# Altium schematic sheet power.SchDoc: Power
size A4; DrawnBy: Adrianna Ascalon
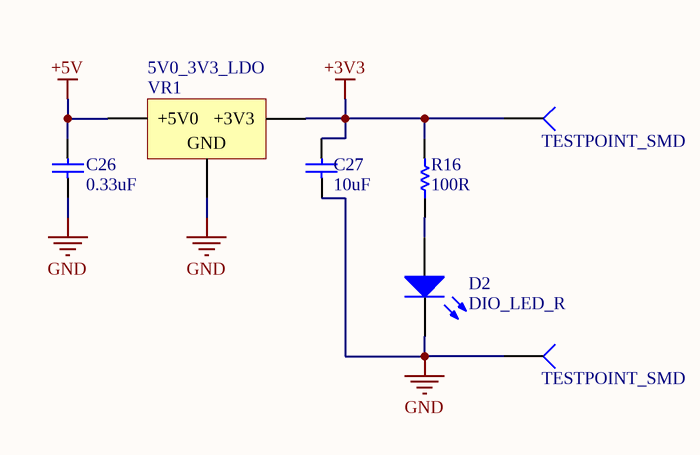
[diagram p0: power.SchDoc]

## Parts
3V3  TESTPOINT_SMD  [TESTPOINT]
C26  value 0.33uF  [CAPC0603(1608)55_N]  (hidden comment: CAP_0.33uF_16V_0603)
C27  10uF  [AVX-CAPC3528_V]
D2  DIO_LED_R  [LED_0805_LINE]
GND  TESTPOINT_SMD  [TESTPOINT]
R16  value 100R  [RESC0603(1608)_N]  (hidden comment: RES_100R_0603)
VR1  5V0_3V3_LDO  [VOLTAGE_REGULATOR]

## Nets
+3V3: 3V3.1(=value) C27.2 R16.2 VR1.2(+3V3)
+5V: C26.2 VR1.3(+5V0)
GND: C26.1 C27.1 D2.2(K) GND.1(=value) VR1.1(GND)
NetD2_1: D2.1(A) R16.1

## Library data of the parts
C26 = CAP_0.33uF_16V_0603: CAP CER 0.33UF 16V X7R 0603; Manufacturer: Murata Electronics North America; MPN: GCM188R71C334KA37D; Dimensions: 0.063" L x 0.031" W (1.60mm x 0.80mm); Package: 0603 (1608 Metric); Temperature Coefficient: X7R; Voltage Rating: 16V; Digikey Part Number: 490-6050-1-ND
C27 = CAP_10uF_0603: CAP CER 10UF 10V X5R 0603; Manufacturer: Yageo; MPN: CC0603MRX5R6BB106; Dimensions: 0.063" L x 0.031" W (1.60mm x 0.80mm); Package: 0603 (1608 Metric); Voltage Rating: 10V; Value: 10uF; Digikey Part Number: 311-1817-1-ND
D2 = DIO_LED_R: LED RED DIFFUSED 0805 SMD; Manufacturer: OSRAM; MPN: LS R976-NR-1; Forward Voltage Drop: 2V; Package: 0805 (2012 Metric); Digikey Part Number: 475-1278-1-ND
R16 = RES_100R_0603: RES SMD 100 OHM 1% 1/10W 0603; Manufacturer: Yageo; MPN: RC0603FR-07100RL; Package: 0603 (1608 Metric); Dimensions: 0.063" L x 0.031" W (1.60mm x 0.80mm); Tolerance: 1%; Digikey Part Number: 311-100HRCT-ND
VR1 = 5V0_3V3_LDO: IC REG LINEAR 3.3V 1A DPAK; Manufacturer: ON Semiconductor; MPN: NCP1117DT33T5G; Current Output: 1A; Digikey Part Number: NCP1117DT33T5GOSCT-ND
3V3 GND = TESTPOINT_SMD: Part Number (MPN): *